# EAGLE design MiniDMXSlave (EAGLE 7.3.0)
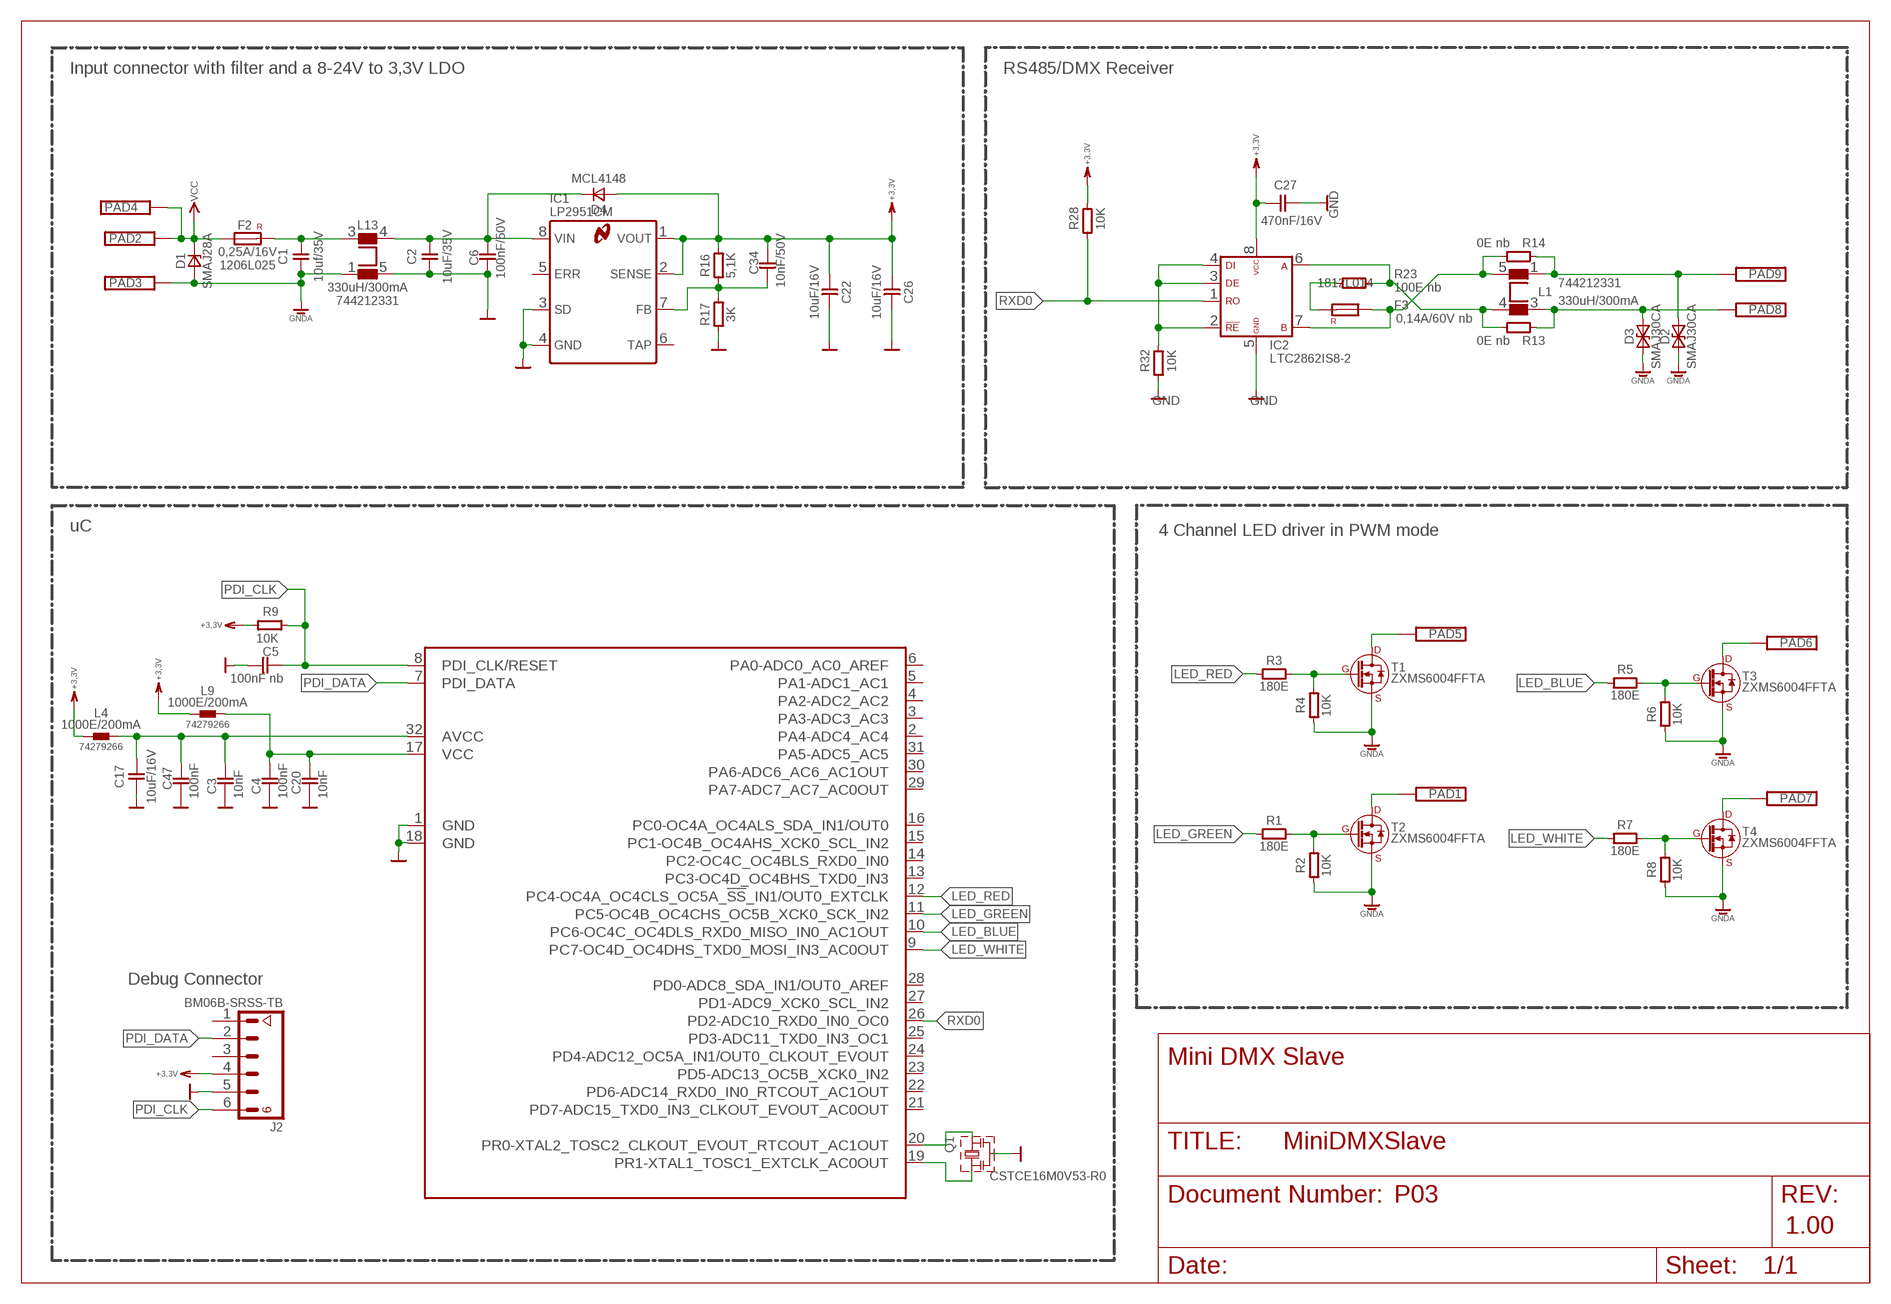
[diagram p0: schematic, sheet 1]

## Parts
C1  10uf/35V  C-1206  [1206]
C2  10uF/35V  C-1206  [1206]
C3  10nF  C-0603  [0603]
C4  100nF  C-0603  [0603]
C5  100nF nb  C-0603  [0603]
C6  100nF/50V  C-0603  [0603]
C17  10uF/16V  C-0805  [0805]
C20  10nF  C-0603  [0603]
C22  10uF/16V  C-0805  [0805]
C26  10uF/16V  C-0805  [0805]
C27  470nF/16V  C-0603  [0603]
C34  10nF/50V  C-0603  [0603]
C47  100nF  C-0603  [0603]
D1  SMAJ28A  [DO-214AC]
D2  SMAJ30CA  [DO-214AC]
D3  SMAJ30CA  [DO-214AC]
D4  MCL4148  [MICROMELF]
F2  0,25A/16V  1206L025  [1206L]
F3  0,14A/60V nb  1812L014  [1812L]
IC1  LP2951CM  [SO8]
IC2  LTC2862IS8-2  [SO8]
IC3  E5-TQFP  [TQFP32]
J2  BM06B-SRSS-TB  [BM06B-SRSS-TB]
L1  330uH/300mA  WE-SL1-330UH/300MA  [WE-SL1]
L4  1000E/200mA  WE-CBF-1000E/200MA-0603  [0603]
L9  1000E/200mA  WE-CBF-1000E/200MA-0603  [0603]
L13  330uH/300mA  WE-SL1-330UH/300MA  [WE-SL1]
PAD1  PADS-6X3  [PAD_6MMX3MM]
PAD2  PADS-6X3  [PAD_6MMX3MM]
PAD3  PADS-6X3  [PAD_6MMX3MM]
PAD4  PADS-6X3  [PAD_6MMX3MM]
PAD5  PADS-6X3  [PAD_6MMX3MM]
PAD6  PADS-6X3  [PAD_6MMX3MM]
PAD7  PADS-6X3  [PAD_6MMX3MM]
PAD8  PADS-6X3  [PAD_6MMX3MM]
PAD9  PADS-6X3  [PAD_6MMX3MM]
Q1  CSTCE16M0V53-R0  CSTCE_G_&_V  [CSTCE_G_&_V]
R1  180E  R-0603  [0603]
R2  10K  R-0603  [0603]
R3  180E  R-0603  [0603]
R4  10K  R-0603  [0603]
R5  180E  R-0603  [0603]
R6  10K  R-0603  [0603]
R7  180E  R-0603  [0603]
R8  10K  R-0603  [0603]
R9  10K  R-0603  [0603]
R13  0E nb  R-0805  [0805]
R14  0E nb  R-0805  [0805]
R16  5,1K  R-0603  [0603]
R17  3K  R-0603  [0603]
R23  100E nb  R-0207  [0207]
R28  10K  R-0603  [0603]
R32  10K  R-0603  [0603]
T1  ZXMS6004FFTA  [SOT-23]
T2  ZXMS6004FFTA  [SOT-23]
T3  ZXMS6004FFTA  [SOT-23]
T4  ZXMS6004FFTA  [SOT-23]

## Nets
+3,3V: C22.1 C26.1 C27.2 C34.2 D4.A IC1.1(VOUT) IC1.2(SENSE) IC2.8(VCC) J2.4 L4.1 L9.1 R9.2 R16.2 R28.2
DHGFHDFGJDJF: C3.2 C17.2 C47.2 IC3.32(AVCC) L4.2
GND: C2.1 C3.1 C4.1 C5.2 C6.1 C17.1 C20.1 C22.2 C26.2 C27.1 C47.1 IC1.3(SD) IC1.4(GND) IC2.5(GND) IC3.1(GND) IC3.18(GND) J2.5 L13.5 Q1.2(GND) R17.1 R32.1
GNDA: C1.1 D1.A D2.K D3.K L13.1 PAD3.1 R2.1 R4.1 R6.1 R8.1 T1.2(S) T2.2(S) T3.2(S) T4.2(S)
LED_BLUE: IC3.10(PC6-OC4C_OC4DLS_RXD0_MISO_IN0_AC1OUT) R5.1
LED_GREEN: IC3.11(PC5-OC4B_OC4CHS_OC5B_XCK0_SCK_IN2) R1.1
LED_RED: IC3.12(PC4-OC4A_OC4CLS_OC5A_!SS!_IN1/OUT0_EXTCLK) R3.1
LED_WHITE: IC3.9(PC7-OC4D_OC4DHS_TXD0_MOSI_IN3_AC0OUT) R7.1
N$1: PAD1.1 T2.3(D)
N$2: R1.2 R2.2 T2.1(G)
N$3: R3.2 R4.2 T1.1(G)
N$4: C2.2 C6.2 D4.K IC1.8(VIN) L13.4
N$6: PAD5.1 T1.3(D)
N$7: R5.2 R6.2 T3.1(G)
N$8: PAD6.1 T3.3(D)
N$9: R7.2 R8.2 T4.1(G)
N$10: C34.1 IC1.7(FB) R16.1 R17.2
N$11: PAD7.1 T4.3(D)
N$12: IC3.20(PR0-XTAL2_TOSC2_CLKOUT_EVOUT_RTCOUT_AC1OUT) Q1.3(OSC2)
N$14: C1.2 F2.2 L13.3
N$16: IC3.19(PR1-XTAL1_TOSC1_EXTCLK_AC0OUT) Q1.1(OSC1)
N$41: F3.2 R23.1
PDI_CLK: C5.1 IC3.8(PDI_CLK/RESET) J2.6 R9.1
PDI_DATA: IC3.7(PDI_DATA) J2.2
QFASFG: C4.2 C20.2 IC3.17(VCC) L9.2
RS485_A: D3.A L1.3 PAD8.1 R13.1
RS485_A1: IC2.6(A) L1.4 R13.2 R23.2
RS485_B: D2.A L1.1 PAD9.1 R14.1
RS485_B0: F3.1 IC2.7(B) L1.5 R14.2
RXD0: IC2.1(R0) IC3.26(PD2-ADC10_RXD0_IN0_OC0) R28.1
TXD0_ENA: IC2.2(/RE) IC2.3(DE) IC2.4(DI) R32.2
VCC: D1.K F2.1 PAD2.1 PAD4.1
Unconnected: IC1.5(ERR) IC1.6(TAP) IC3.2(PA4-ADC4_AC4) IC3.3(PA3-ADC3_AC3) IC3.4(PA2-ADC2_AC2) IC3.5(PA1-ADC1_AC1) IC3.6(PA0-ADC0_AC0_AREF) IC3.13(PC3-OC4D_OC4BHS_TXD0_IN3) IC3.14(PC2-OC4C_OC4BLS_RXD0_IN0) IC3.15(PC1-OC4B_OC4AHS_XCK0_SCL_IN2) IC3.16(PC0-OC4A_OC4ALS_SDA_IN1/OUT0) IC3.21(PD7-ADC15_TXD0_IN3_CLKOUT_EVOUT_AC0OUT) IC3.22(PD6-ADC14_RXD0_IN0_RTCOUT_AC1OUT) IC3.23(PD5-ADC13_OC5B_XCK0_IN2) IC3.24(PD4-ADC12_OC5A_IN1/OUT0_CLKOUT_EVOUT) IC3.25(PD3-ADC11_TXD0_IN3_OC1) IC3.27(PD1-ADC9_XCK0_SCL_IN2) IC3.28(PD0-ADC8_SDA_IN1/OUT0_AREF) IC3.29(PA7-ADC7_AC7_AC0OUT) IC3.30(PA6-ADC6_AC6_AC1OUT) IC3.31(PA5-ADC5_AC5) J2.1 J2.3

## Notes on the sheet
- Input connector with filter and a 8-24V to 3,3V LDO | RS485/DMX Receiver
- uC | 4 Channel LED driver in PWM mode
- Pull up und pull down auf Gegenstelle!
- Debug Connector
- Mini DMX Slave
- P03
- 1.00
- Note3:
  Uout=1,235/3K*(3K+5K1) = 3,33V

## Library data of the parts
C1 C2 C17 C22 C26 = 110_PASSIV:C: PASSIVE - Bauelement C; HEIGHT: 0.85
C3-C6 C20 C27 C34 C47 = 110_PASSIV:C: PASSIVE - Bauelement C; HEIGHT: 0.3
D1 = 100_DIODE:SMAJ*A: Transient Voltage Suppressors - SMAJ Series Bild/ Picture Merkmale/ Features Low profile package Ideal for automated placement Excellent clamping capability 400W peak pulse power capability with a 10/1000µs waveform, repetitive rate (duty cycle): 0,01% (300W above 78V) Very fast response time Anwendungen/ Applications TVS devices are ideal for protection of I/O Interfaces, VCC bus and other vulnerable circuits used in Telecom, Computer, Industrial and Consumer electronic applications. Beschreibung/ Description The SMAJ series is designed specifically to protect sensitive electronic equipment from voltage transients induced by lightning and other transient voltage events. Link Datenblatt - Vishay <http://www.vishay.com/docs/88390/smaj50a.pdf> Datenblatt - Littelfuse <http://www.littelfuse.com/products/tvs-diodes/surface-mount/~/media/Electronics/Datasheets/TVS_Diodes/Littelfuse_TVS_Diode_SMAJ_Datasheet.pdf.pdf> Datenblatt - ST <http://www.st.com/st-web-ui/static/active/en/resource/technical/document/datasheet/CD00001333.pdf> EBBE, 27.11.2013; DE-ID: 31251; HEIGHT: 2.3; I_PP: 8,8A; V_BR-MAX: 34,4V; V_BR-MIN: 31,1V; V_CL: 45,4V
D2 D3 = 100_DIODE:SMAJ*CA: Transient Voltage Suppressors - SMAJ Series Bild/ Picture Merkmale/ Features Low profile package Ideal for automated placement Excellent clamping capability 400W peak pulse power capability with a 10/1000µs waveform, repetitive rate (duty cycle): 0,01% (300W above 78V) Very fast response time Anwendungen/ Applications TVS devices are ideal for protection of I/O Interfaces, VCC bus and other vulnerable circuits used in Telecom, Computer, Industrial and Consumer electronic applications. Beschreibung/ Description The SMAJ series is designed specifically to protect sensitive electronic equipment from voltage transients induced by lightning and other transient voltage events. Link Datenblatt - Vishay <http://www.vishay.com/docs/88390/smaj50a.pdf> Datenblatt - Littelfuse <http://www.littelfuse.com/products/tvs-diodes/surface-mount/~/media/Electronics/Datasheets/TVS_Diodes/Littelfuse_TVS_Diode_SMAJ_Datasheet.pdf.pdf> Datenblatt - ST <http://www.st.com/st-web-ui/static/active/en/resource/technical/document/datasheet/CD00001333.pdf> EBBE, 27.11.2013; DE-ID: 47526; HEIGHT: 2,45; I_PP: 8,3A; V_BR-MAX: 36,8V; V_BR-MIN: 33,3V; V_CL: 48,4V
D4 = 100_DIODE:?4148: MCL4148 ID: S36809 Fast Switching Diode Features Silicon Epitaxial Planar Diodes Saving space Hermetic sealed parts Fits onto SOD 323 / SOT 23 footprints Electrical data identical with the devices 1N4148 and 1N4448 respectively Micro Melf package Applications Extreme fast switches LL4148 ID: S12833 Fast Switching Diode Features Silicon Epitaxial Planar Diodes Electrical data identical with the devices 1N4148 and 1N4448 respectively Applications Extreme fast switches Autor: LETI; HEIGHT: 1.2
F2 = 150_FUSES:1206L*: 1206L Series < POLY-FUSE Resettable PTCs Bild/ Picture Merkmale/ Features RoHS compliant, lead-free and halogen-free Fast response to fault currents Compact design saves board space Low resistance Low-profile Compatible with high temperature solders Anwendungen/ Applications --- Beschreibung/ Description The 1206L Series PTC provides surface mount overcurrent protection for applications where space is at a premium and resettable protection is desired. Link Datenblatt <http://www.littelfuse.com/products/resettable-ptcs/surface-mount/~/media/Electronics/Datasheets/Resettable_PTCs/Littelfuse_PTC_1206L_Datasheet.pdf.pdf> EBBE, 25.11.2013; DE-ID: 47817; MPN: 1206L025; RESISTANCE-MAX: 2,3E; RESISTANCE-MIN: 0,55E
F3 = 150_FUSES:1812L*: 1812L Series < POLY-FUSE Resettable PTCs Bild/ Picture Merkmale/ Features RoHS compliant, lead-free and halogen-free Fast response Compact design Low resistance Low-profile Compatible with high temperature solders Anwendungen/ Applications --- Beschreibung/ Description The 1812L Series PTC provides surface mount overcurrent protection for applications where resettable protection is desired. Link Datenblatt <http://www.littelfuse.com/products/resettable-ptcs/surface-mount/~/media/Electronics/Datasheets/Resettable_PTCs/Littelfuse_PTC_1812L_Datasheet.pdf.pdf> EBBE, 27.11.2013 update LETI, 16.10.2014 (1812L014); DE-ID: 48868; HEIGHT: 1.95; MPN: 1812L014; RESISTANCE-MAX: 6E; RESISTANCE-MIN: 1,5E; VALUE: 0,14A/60V
IC1 = 270_NATIONAL:LP2951CM: Adjustable Micropower Voltage Regulators Merkmale/ Features High Accuracy Output Voltage Ensured 100mA Output Current Extremely Low Quiescent Current Low Dropout Voltage Very Low Temperature Coefficient Current and Thermal Limiting Anwendungen/ Applications Beschreibung/ Description The LP2950-N and LP2951-N are micropower voltage regulators with very low quiescent current (75μA typ.) and very low dropout voltage (typ. 40mV at light loads and 380mV at 100mA). They are ideally suited for use in battery-powered systems. Furthermore, the quiescent current of the LP2950- N/LP2951-N increases only slightly in dropout, prolonging battery life. Link Datenblatt <http://www.ti.com/lit/ds/snvs764n/snvs764n.pdf> update SMAN, 22.04.2013; DE-ID: 12724
IC2 = 260_LINEAR_TECHNOLOGY:LTC2862*?-2: ±60V Fault Protected 3V to 5.5V RS485/RS422 Transceivers Bild/ Picture Merkmale/ Features Protected from Overvoltage Line Faults to ±60V 3V to 5.5V Supply Voltage 20Mbps or Low EMI 250kbps Data Rate ±15kV ESD Interface Pins, ±8kV All Other Pins Extended Common Mode Range: ±25V Guaranteed Failsafe Receiver Operation High Input Impedance Supports 256 Nodes 1.65V to 5.5V Logic Supply Pin (VL) for Flexible Digital Interface (LTC2865) MP-Grade Option Available (–55°C to 125°C) Fully Balanced Differential Receiver Thresholds for Low Duty Cycle Distortion Current Limited Drivers and Thermal Shutdown Pin Compatible with LT1785 and LT1791 Available in DFN and Leaded Packages Anwendungen/ Applications Supervisory Control and Data Acquisition (SCADA) Industrial Control and Instrumentation Networks Automotive and Transportation Electronics Building Automation, Security Systems and HVAC Medical Equipment Lighting and Sound System Control Beschreibung/ Description The LT C®2862/LTC2863/LTC2864/LTC2865 are low power, 20Mbps or 250kbps RS485/RS422 transceivers operating on 3V to 5.5V supplies that feature ±60V overvoltage fault protection on the data transmission lines during all modes of operation, including power-down. Low EMI slew rate limited data transmission is available in a logic-selectable 250kbps mode in the LTC2865 and in 250kbps versions of the LTC2862-LTC2864. Enhanced ESD protection allows these parts to withstand ±15kV HBM on the transceiver interface pins without latchup or damage. Extended ±25V input common mode range and full fail- safe operation improve data communication reliability in electrically noisy environments and in the presence of large ground loop voltages. Link Datenblatt <http://cds.linear.com/docs/en/datasheet/2862345fb.pdf> update LETI, 18.03.2014; HEIGHT: 1.752; HERSTELLER: Liniar Technology; ID: 91903; K: S; MPN: LTC2862IS8-2#TRPBF
IC3 = e5:E5
J2 = 310_JST:?M06B-SRSS-TB: SH Connector The SH connector is very small with mounting height of 2.95mm for side entry type. Specifications Rastermaß: 1mm Current rating: 1.0A AC, DC (AWG #28) Voltage rating: 50V AC, DC Temperature range: -25°C to 85°C AWG #32 to #28 Id's BM06B-SRSS-TB: S45132 SM06B-SRSS-TB: S60032 Gegenstecker ZH: F18492 SFH-Kontakte: F18493 Autor: SMAN
L1 L13 = 220_WUERTH:WE-SL1: WE-SL1 Stromkompensierter SMD Line Filter Bild/ Picture Merkmale/ Features Geringe Bauhöhe, nur 1,65mm Strombelastbarkeit bis 300mA Betriebstemperatur: –40 °C bis +105 °C Betriebsspannung: 80VDC (42VAC) Empfohlenes Lötverfahren: Reflow Anwendungen/ Applications USB CAN Firewire Datenleitungen Spannungsversorgung Messsignal-Leitung/Sensorleitung Unterdrückung von Gleichtaktstörung Beschreibung/ Description --- Link Datenblatt <http://katalog.we-online.de/de/pbs/WE-SL1> EBBE, 23.10.2013; DE-ID: 65007; HEIGHT: 1.65; MPN: 744212331; R-DC: 0,3E; U-R: 80V; U-T: 250VAC; WICKLUNGSTECHNIK: sektionell; Z: 2000E
L4 L9 = 220_WUERTH:WE-CBF: WE-CBF SMD EMI Suppression Ferrite Bead Bild/ Picture Merkmale/ Features Hochwertige Ni-Sn Elektroden Sehr hohe Stromtragfähigkeit bis 6A Empfohlenes Lötverfahren: Reflow Betriebstemperatur: -55°C bis +125°C Anwendungen/ Applications Ideal als Datenleitungsfilter und zur Versorgungsspannungsentkopplung Beschreibung/ Description Die speziellen Miniatur-SMD-Ferrite in Multilayertechnik werden direkt auf die Platine gelötet. Sie besitzen sehr gute Filtereigenschaften und einen geringen Gleichstrom-Widerstand. Nahe an der Störquelle platziert, können selbst bei kleinster Bauform 0402, maximale Impedanzen um 1000 Ω erzielt werden. Link Datenblatt <http://katalog.we-online.de/de/pbs/WE-CBF> EBBE, 17.10.2013; DE-ID: 57166; HEIGHT: 0.8; I-R: 200mA; MPN: 74279266; R-DC: 0,6E; TC_Z-MAX: 140MHz; Z-100MHZ: 1000E; Z-MAX: 1350E
PAD1-PAD9 = 050_CON_GENERAL:PADS: Revisions History: - 24.10.08, SMAN: Pad mit Durchm. 3mm erstellt - 15.07.09, EBBE: Pad-Variante "-6x5mm" erstellt - 25.08.09, SMAN: Pad-Variante "-6X4_+HOLE_D1,4MM" erstellt
Q1 = 460_QUARZ:CSTC?*: Manufacturer: muRata Drawing: http://www.murata.com/products/catalog/pdf/p16e.pdf CSTCE - Ceramic Resonator (CERALOCK) / 7.2 x 3mm Dimension: 7.2 x 3.0mm CSTCC_G_A ... 2.00 to 3.99 MHz CSTCE - Ceramic Resonator (CERALOCK) / 3.2 x 1.3mm Dimension: 3.2 x 1.3mm CSTCE_G_B ... 4.00 to 7.99 MHz CSTCE_G15C ... 8.00 to 13.99 MHz CSTCE_V13C ... 14.00 to 20.00 MHz CSTCR - Ceramic Resonator (CERALOCK) / 4.5 x 2.0mm Dimension: 4.5 x 2.0mm CSTCV - Ceramic Resonator (CERALOCK) / 3.7 x 3.1mm Dimension: 3.7 x 3.1mm CSTCV_X_Q ... 20.01 to 70.00 MHz SMAN (sman@diel.co.at) Updated 27/10/2009; HEIGHT: 1
R1-R9 R16 R17 R28 R32 = 110_PASSIV:R: PASSIVE - Bauelemente R; HEIGHT: 0.6
R13 R14 = 110_PASSIV:R: PASSIVE - Bauelemente R; HEIGHT: 0.85
R23 = 110_PASSIV:R: PASSIVE - Bauelemente R; HEIGHT: 2.6
T1-T4 = 080_N-FET:ZXMS6004?TA: 60V N-CHANNEL SELF PROTECTED ENHANCEMENT MODE INTELLIFET™ MOSFET Bild/ Picture Merkmale/ Features Compact high power dissipation package Low input current Logic Level Input (3.3V and 5V) Short circuit protection with auto restart Over voltage protection (active clamp) Thermal shutdown with auto restart Over-current protection Input Protection (ESD) High continuous current rating Totally Lead-Free & Fully RoHS compliant (Notes 1 & 2) Halogen and Antimony Free. “Green” Device (Note 3) Qualified to AEC-Q101 Standards for High Reliability Anwendungen/ Applications Especially suited for loads with a high in-rush current such as lamps and motors All types of resistive, inductiveand capacitive loads in switching applications μC compatible power switch for 12V and 24V DC applications Automotive rated Replaces electromechanicalrelays and discrete circuits Linear Mode capability - the current-limiting protection circuitry is designed to de-activate at low VDS to minimize on state power dissipation. The maximum DC operating current is therefore determined by the thermal capability of the package/board combination, rather than by the protection circuitry. This does not compromise the product’s ability to self-protect at low VDS. Beschreibung/ Description The ZXMS6004FF is a self protected low side MOSFET with logic level input. It integrates over-temperature, over-current, over-voltage (active clamp) and ESD protected logic level functionality. The ZXMS6004FF is ideal as a general purpose switch driven from 3.3V or 5V microcontrollers in harsh environments where standard MOSFETs are not rugged enough. Link Datenblatt <http://diodes.com/datasheets/ZXMS6004FF.pdf> LETI, 26.09.2014; HEIGHT: 1

## Board
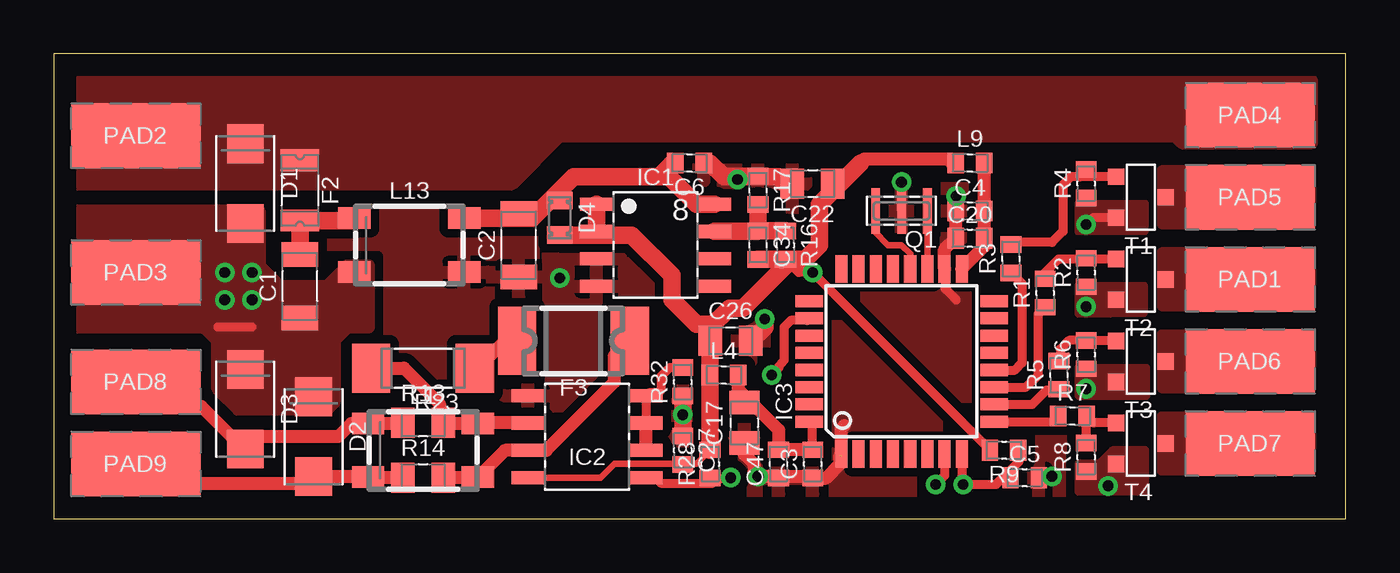
[diagram p1: board, top side]
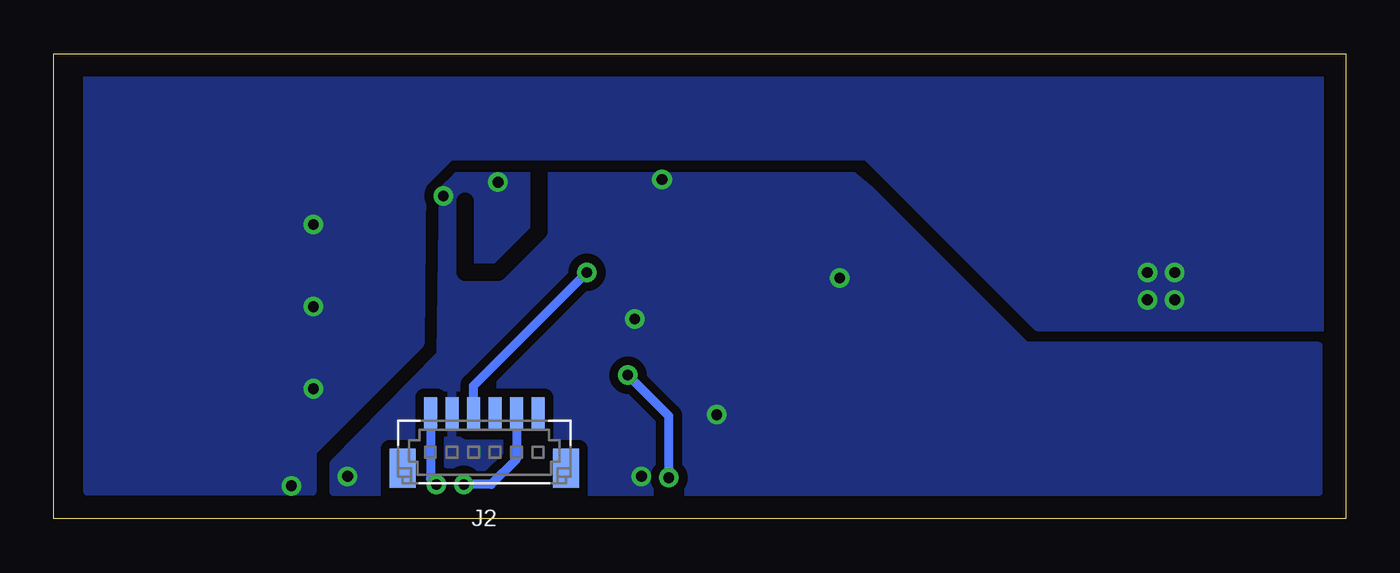
[diagram p2: board, bottom side, seen from below]

Size 59.99 x 21.58 mm. Coordinates in mm from the lower left corner, seen from the top.
Outline: 0,0 59.99,0 59.99,21.58 0,21.58 0,0
Copper layers (1*16): Top 0.035mm / dielectric 1.5mm / Bottom 0.035mm
Design rules "default": minimum track width 10mil, minimum drill 24mil, track to track 8mil, track to pad 8mil, pad to pad 8mil, via to via 8mil, smd to smd 8mil, copper to edge 40mil, drill to drill 8mil, minimum pad ring 10mil, minimum via ring 8mil, stop-mask expansion 4mil, vias tented up to drill 0mil, thermal gap 10mil
bRestrict: 4 lines

### Footprints (pad centres in the part's own frame; a part is rotated, then mirrored left to right if it is on the bottom)
1206 = smd 1.143 x 1.702: 1 -1.473,0; 2 1.473,0
0603 = smd 0.762 x 0.965: 1 -0.66,0; 2 0.66,0
0805 = smd 1.092 x 1.397: 1 -0.94,0; 2 0.94,0
DO-214AC = smd 1.8 x 1.7: A 1.85,0; K -1.85,0
MICROMELF = smd 0.8 x 1.2: A 0.8,0; K -0.8,0
1206L = smd 1 x 1.8: 1 -1.4,0; 2 1.4,0
1812L = smd 1.78 x 3.15: 1 -2.615,0; 2 2.615,0
SO8 = smd 1.524 x 0.61: 1 -2.743,1.905; 2 -2.743,0.635; 3 -2.743,-0.635; 4 -2.743,-1.905; 5 2.743,-1.905; 6 2.743,-0.635; 7 2.743,0.635; 8 2.743,1.905
TQFP32 = smd 1.27 x 0.559: 1 -4.293,2.8; 2 -4.293,2; 3 -4.293,1.2; 4 -4.293,0.4; 5 -4.293,-0.4; 6 -4.293,-1.2; 7 -4.293,-2; 8 -4.293,-2.8; 17 4.293,-2.8; 18 4.293,-2; 19 4.293,-1.2; 20 4.293,-0.4; 21 4.293,0.4; 22 4.293,1.2; 23 4.293,2; 24 4.293,2.8 | smd 0.559 x 1.27: 9 -2.8,-4.293; 10 -2,-4.293; 11 -1.2,-4.293; 12 -0.4,-4.293; 13 0.4,-4.293; 14 1.2,-4.293; 15 2,-4.293; 16 2.8,-4.293; 25 2.8,4.293; 26 2,4.293; 27 1.2,4.293; 28 0.4,4.293; 29 -0.4,4.293; 30 -1.2,4.293; 31 -2,4.293; 32 -2.8,4.293
BM06B-SRSS-TB = smd 0.6 x 1.55: 1 -2.5,-2.325; 2 -1.5,-2.325; 3 -0.5,-2.325; 4 0.5,-2.325; 5 1.5,-2.325; 6 2.5,-2.325 | smd 1.2 x 1.8: P$10 -3.8,0.2; P$11 3.8,0.2
WE-SL1 = smd 1.5 x 1: 1 -2.55,-1.25; 3 -2.55,1.25; 4 2.55,1.25; 5 2.55,-1.25
PAD_6MMX3MM = smd 6 x 3: 1 0,0
CSTCE_G_&_V = smd 0.4 x 2.1: 1 -1.2,0; 2 0,0; 3 1.2,0
0207 = smd 1.778 x 2.286: 1 -2.413,0; 2 2.413,0
SOT-23 = smd 0.76 x 0.76: 1 1.15,-0.95; 2 1.15,0.95; 3 -1.15,0

### Placement (x,y rotation side)
C1  11.43,10.79 90 top
C2  21.59,12.7 90 top
C3  35.24,2.54 90 top
C4  42.55,14.29 0 top
C5  45.09,1.91 0 top
C6  29.53,16.51 180 top
C17  32.07,4.45 90 top
C20  42.55,13.02 0 top
C22  35.24,15.56 180 top
C26  31.43,8.26 0 top
C27  29.21,3.17 270 top
C34  32.7,12.7 270 top
C47  33.66,2.54 90 top
D1  8.89,15.56 270 top
D2  12.06,3.81 270 top
D3  8.89,5.08 270 top
D4  23.5,13.97 270 top
F2  11.43,15.24 270 top
F3  24.13,8.26 180 top
IC1  27.94,12.7 0 top
IC2  24.77,3.81 180 top
IC3  39.37,7.3 90 top
J2  40.01,2.54 180 bottom
L1  17.14,3.17 0 top
L4  31.11,6.67 0 top
L9  42.55,16.51 0 top
L13  16.51,12.7 0 top
PAD1  55.56,11.11 0 top
PAD2  3.81,17.78 0 top
PAD3  3.81,11.43 0 top
PAD4  55.56,18.73 0 top
PAD5  55.56,14.92 0 top
PAD6  55.56,7.3 0 top
PAD7  55.56,3.49 0 top
PAD8  3.81,6.35 0 top
PAD9  3.81,2.54 0 top
Q1  39.37,14.29 180 top
R1  46.04,10.48 90 top
R2  47.94,11.43 90 top
R3  44.45,12.06 90 top
R4  47.94,15.56 90 top
R5  46.67,6.67 90 top
R6  47.94,7.62 90 top
R7  47.31,4.76 0 top
R8  47.94,2.86 90 top
R9  44.13,3.17 180 top
R13  17.14,4.45 0 top
R14  17.14,1.91 0 top
R16  33.97,12.7 270 top
R17  32.7,15.24 270 top
R23  17.14,6.99 180 top
R28  30.48,2.54 90 top
R32  29.21,6.35 90 top
T1  50.48,14.92 180 top
T2  50.48,11.11 180 top
T3  50.48,7.3 180 top
T4  50.48,3.49 180 top

### Tracks (layer width: path | path; a pad name or v marks a point on that pad's centre or on a via)
+3,3V  (via drill 0.5)
  Top 0.305: IC2.8 25.4,1.91 26.04,2.54 29.21,2.54 29.84,2.54 30.48,3.17 30.5,3.2
  Top 0.406: C27.2 29.21,2.54 | 34.9,12.04 34.92,12.01 34.92,11.75 v35.24,11.43 | R9.2 43.47,3.2 v35.24,11.43 | v35.24,11.43 34.58,11.43 R16.2 | IC1.2 25.87,13.34 26.04,13.17
  Top 0.61: L4.1 30.48,6.67 | L9.1 41.71,16.51 41.53,16.69 37.64,16.69 37.47,16.51
  Top 0.813: D4.A 26.04,13.17 26.84,13.17 28.7,11.3 28.7,10.16 29.84,9.02 30.35,9.02 30.48,8.89 | 30.48,3.17 R28.2 30.48,6.67 30.48,8.57 | IC1.1 IC1.2 | 30.48,8.57 30.48,8.89 | 30.48,8.89 31.37,9.78 32,9.78 33.97,11.75 R16.2 | C26.1 30.49,8.56 30.48,8.57 | R16.2 C34.2 | R16.2 34.9,12.04 35.56,12.7 35.56,14.61 36.18,15.23 | 36.18,15.23 37.47,16.51 | C22.1 36.18,15.23
  Bottom 0.406: J2.4 40.51,6.17 v35.24,11.43
DHGFHDFGJDJF
  Top 0.406: C3.2 35.24,4.34 IC3.32
  Top 0.61: L4.2 31.77,6.01 32.07,5.71 | 32.07,5.71 33.66,4.13 C47.2 C3.2 | C17.2 32.07,5.71
GND  (via drill 0.5)  (1 unrouted)
  Top 0.406: Q1.2 v39.37,15.62 | v41.91,14.99 41.91,14.31 C4.1 | 41.4,11.63 41.4,10.67 41.91,10.16 | 41.4,11.68 41.4,11.63 | 41.4,11.63 IC3.18
  Top 0.61: 33.66,1.97 v32.7,1.97 32.51,2.16 32.51,2.54 32.07,2.98 C17.1 | 33.66,1.97 35.15,1.97 C3.1 35.85,1.88 36.51,2.54 36.51,2.95 IC3.1 | C47.1 33.66,1.97 | IC3.18 41.37,12.5 C20.1 C4.1 | 31.62,15.88 v31.75,15.75 | v46.35,1.97 45.81,1.97 C5.2 | 36.58,2.92 36.58,4.19 36.7,4.32
  Top 0.813: R32.1 v29.21,4.83 C27.1 | C26.2 32.38,8.26 33.02,8.89 v33.02,9.27 | C6.1 30.48,16.51 31.11,15.88 | R17.1 31.14,15.9 31.11,15.88 | 31.11,15.88 31.75,15.88 v31.75,15.75 31.88,15.88 33.66,15.88 33.97,15.56 C22.2
  other vias: 23.5,11.18
  pour Top (isolate 0.406, rank 2): 0.95,14.29 22.23,14.29 24.13,16.19 50.48,16.19 50.48,1.27 0.95,1.27
  pour Bottom (isolate 0.406): 1.27,8 14.86,8 22.1,15.24 22.86,15.88 41.27,15.88 41.91,15.24 42.04,7.62 46.99,2.54 46.99,1.27 1.27,1.27
GNDA  (via drill 0.5)
  Top 0.406: T1.2 48.29,13.97 | 9.21,8.89 7.62,8.89
  other vias: 7.94,11.43 9.21,11.43 7.94,10.16 9.21,10.16 47.94,6.03 47.94,9.84 47.94,13.65 48.96,1.52
  pour Top (no thermals): 47.62,2.54 48.58,2.54 49.21,3.17 50.65,3.17 50.65,1.27 47.62,1.27
  pour Top (no thermals): 47.62,6.99 50.7,6.99 50.7,5.71 47.62,5.71
  pour Top (no thermals): 47.62,10.79 49.21,10.79 50.6,10.82 50.6,9.55 47.62,9.53
  pour Top (no thermals): 47.62,14.61 49.21,14.61 50.62,14.63 50.62,13.36 47.62,13.34
  pour Top (isolate 0.305, no thermals): 0.95,14.29 9.53,14.29 9.53,11.75 10.48,10.79 12.7,10.79 13.65,11.75 14.61,11.75 14.61,8.89 13.65,8.89 13.02,8.26 13.02,5.4 12.7,5.08 8.57,5.08 7.62,6.03 7.62,8.26 6.99,8.89 0.95,8.89
  pour Bottom (isolate 0.406): 0.95,8.89 14.29,8.89 22.23,16.83 41.59,16.83 42.93,15.49 42.99,8.13 48.01,3.11 48.01,1.27 58.42,1.27 58.42,20.64 0.95,20.64
LED_BLUE
  Top 0.406: IC3.10 45.43,5.3 46.1,5.97 46.63,5.97 R5.1
LED_GREEN
  Top 0.406: IC3.11 45.16,6.1 45.72,6.67 45.72,9.5 R1.1
LED_RED
  Top 0.406: IC3.12 44.62,6.9 44.96,7.24 44.96,10.92 44.48,11.4 R3.1
LED_WHITE
  Top 0.406: IC3.9 46.39,4.5 R7.1
N$1
  pour Top (no thermals): 58.42,12.38 51.44,12.38 51.44,9.84 58.42,9.84
N$2
  Top 0.406: R1.2 46.04,11.43 46.67,12.06 47.94,12.06 | 47.94,12.06 T2.1 | R2.2 47.94,12.06
N$3
  Top 0.406: T1.1 47.63,15.87 47.62,15.88 47.62,15.9 R4.2 47.6,15.88 47.24,15.88 46.86,15.49 46.86,13.34 46.35,12.83 44.55,12.83 R3.2
N$4
  Top 0.406: D4.K 23.33,14.77 23.18,14.92 | C2.2 21.68,14.17 21.91,13.95
  Top 0.61: C6.2 28.57,16.51 27.94,15.88
  Top 0.813: L13.4 21.91,13.95 22.2,13.95 23.18,14.92 24.13,15.88 27.94,15.88 28.57,15.88 29.84,14.61 IC1.8
N$6
  pour Top (no thermals): 58.42,16.19 51.44,16.19 51.44,13.65 58.42,13.65
N$7
  Top 0.406: T3.1 49.3,8.28 R6.2 47.14,8.28 46.74,7.87 46.74,7.39 R5.2
N$8
  pour Top (no thermals): 58.42,8.57 51.44,8.57 51.44,6.03 58.42,6.03
N$9
  Top 0.406: T4.1 48.29,4.44 R7.2 47.94,4.74 R8.2
N$10
  Top 0.813: R17.2 C34.1 | R16.1 C34.1 | IC1.7 32.68,13.34 C34.1
N$11
  pour Top (no thermals): 58.42,4.76 51.44,4.76 51.44,2.22 58.42,2.22
N$12
  Top 0.305: IC3.20 39.77,12.3 39.37,12.7 38.73,12.7 38.1,13.34 38.1,14.22 Q1.3
N$14
  Top 0.813: C1.2 F2.2 13.85,13.84 L13.3
N$16
  Top 0.305: Q1.1 IC3.19
N$41
  Top 0.61: R23.1 19.68,6.99 20.95,8.26 F3.2
PDI_CLK  (via drill 0.5)
  Top 0.406: IC3.8 42.17,1.96 42.55,1.59 | 42.55,1.59 43.75,1.59 44.26,2.1 | 44.26,2.1 44.83,2.67 44.83,3.14 R9.1 | C5.1 44.42,1.93 44.26,2.1 | 42.55,1.59 v42.23,1.59
  Bottom 0.406: J2.6 42.51,1.86 v42.23,1.59
PDI_DATA  (via drill 0.5)
  Top 0.406: IC3.7 41.37,2 v40.96,1.59
  Bottom 0.406: J2.2 38.51,2.77 39.69,1.59 v40.96,1.59
QFASFG
  Top 0.61: L9.2 C4.2 43.2,13.97 C20.2 43.2,12.63 IC3.17
RS485_A
  Top 0.406: L1.3 14.62,4.45
  Top 0.61: 8.89,3.81 13.21,3.81 13.82,4.42 L1.3 16.18,4.42 R13.1 | 8.89,3.81 8.26,3.81 6.86,5.21 5.59,5.21 5.08,5.71 4.45,5.71 PAD8.1 | D3.A 8.89,3.81
RS485_A1
  Top 0.406: 18.11,4.42 R13.2
  Top 0.61: R23.2 16.26,6.99 17.91,5.33 17.91,4.62 R13.2 | IC2.6 19.71,4.45 L1.4 18.11,4.42
RS485_B
  Top 0.406: 14.62,1.91 L1.1
  Top 0.61: PAD9.1 5.59,2.54 6.48,1.65 11.76,1.65 D2.A 14.56,1.96 L1.1 16.18,1.93 R14.1
RS485_B0
  Top 0.406: 18.11,1.93 R14.2
  Top 0.61: 18.11,1.93 L1.5 20.95,3.17 IC2.7 22.86,3.17 26.04,6.35 26.04,7.54 F3.1
RXD0  (via drill 0.5)
  Top 0.406: IC2.1 27.94,1.91 28.19,1.65 30.61,1.65 30.61,1.75 R28.1 31.41,1.88 v31.43,1.91 | IC3.26 34.98,9.21 34.23,9.21 33.91,8.89 33.91,7.37 v33.34,6.67 33.66,6.99
  Bottom 0.406: v31.43,1.91 31.43,4.76 v33.34,6.67
TXD0_ENA
  Top 0.406: R32.2 28.6,7.01 28.19,6.6 28.19,5.97 28.07,5.84 27.64,5.84 IC2.4 IC2.3
  Top 0.61: IC2.2 IC2.3
VCC
  pour Top (isolate 0.406, no thermals): 58.42,20.32 0.95,20.32 0.95,15.56 21.27,15.56 23.5,17.78 52.07,17.78 52.39,17.46 58.42,17.46